# Altium schematic sheet TIMER_COUNTER_PANEL.SchDoc
size 381 x 241 mm; SheetNumber: 1; SheetTotal: 1
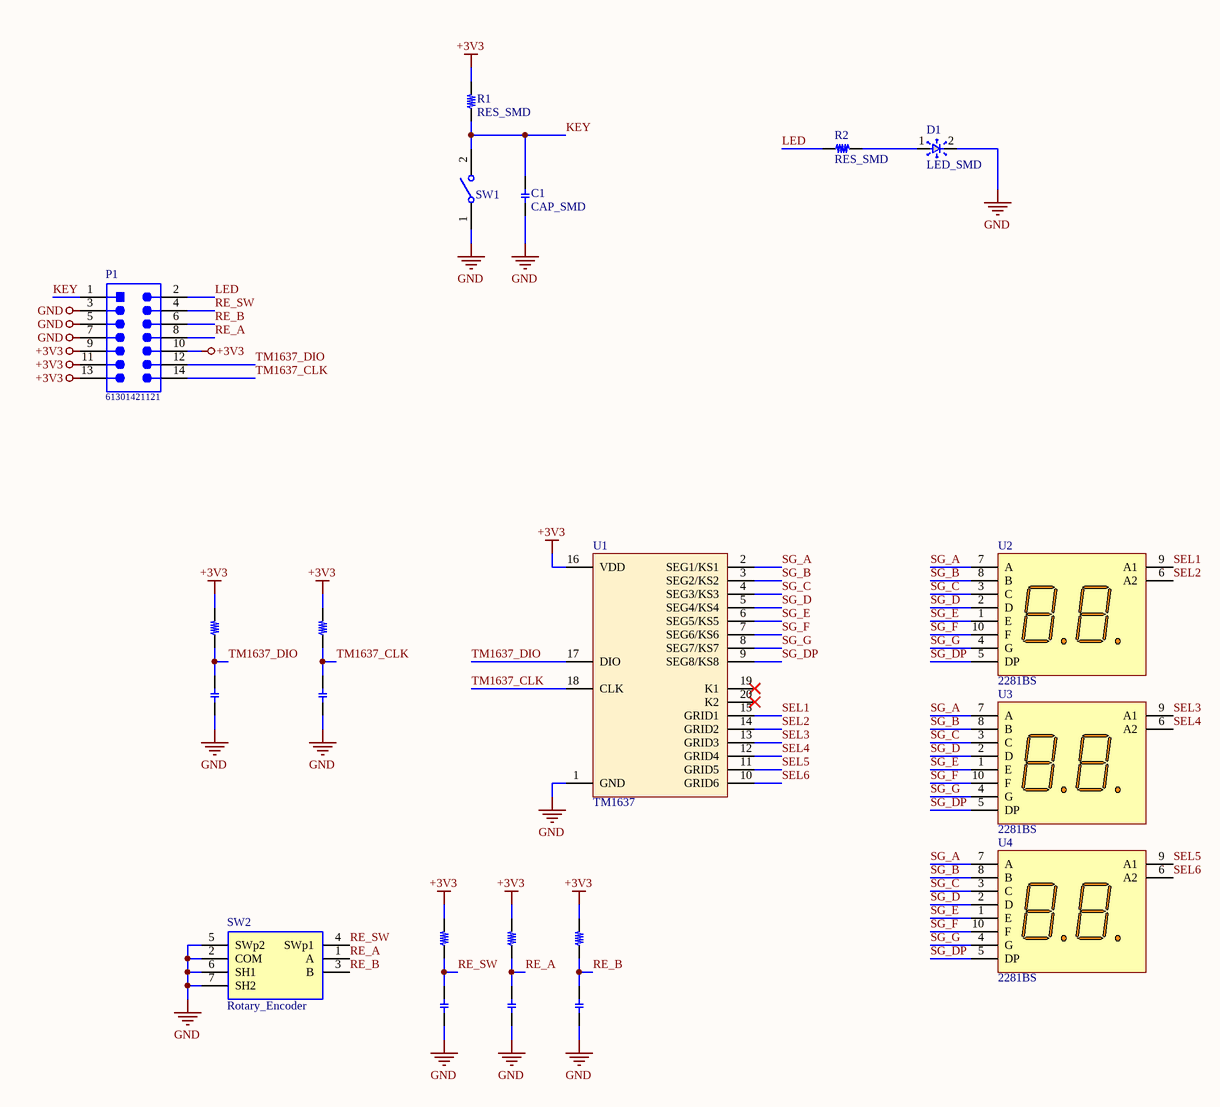
[diagram p0: TIMER_COUNTER_PANEL.SchDoc]

## Parts
C1  CAP_SMD  [C 0603]
C2  CAP_SMD  [C 0603]  (value not drawn)
C3  CAP_SMD  [C 0603]  (value not drawn)
C4  CAP_SMD  [C 0603]  (value not drawn)
C5  CAP_SMD  [C 0603]  (value not drawn)
C6  CAP_SMD  [C 0603]  (value not drawn)
D1  LED_SMD  [D 0603]
P1  61301421121  [61301421121]
R1  RES_SMD  [R 0603]
R2  RES_SMD  [R 0603]
R3  RES_SMD  [R 0603]  (value not drawn)
R4  RES_SMD  [R 0603]  (value not drawn)
R5  RES_SMD  [R 0603]  (value not drawn)
R6  RES_SMD  [R 0603]  (value not drawn)
R7  RES_SMD  [R 0603]  (value not drawn)
SW1  430133050816  [WS-TASV_L6W6H5_4301330508x6]  (value not drawn)
SW2  Rotary_Encoder  [Rotary_Encoder]
U1  TM1637  [SOP-20]
U2  2281BS  [2281BS]
U3  2281BS  [2281BS]
U4  2281BS  [2281BS]

## Nets
+3V3: P1.9 P1.10 P1.11 P1.13 R1.2 R3.2 R4.2 R5.2 R6.2 R7.2 U1.16(VDD)
GND: C1.1 C2.1 C3.1 C4.1 C5.1 C6.1 D1.2 P1.3 P1.5 P1.7 SW1.1 SW2.2(COM) SW2.5(SWp2) SW2.6(SH1) SW2.7(SH2) U1.1(GND)
KEY: C1.2 P1.1 R1.1 SW1.2
LED: P1.2 R2.1
RE_A: C5.2 P1.8 R6.1 SW2.1(A)
RE_B: C6.2 P1.6 R7.1 SW2.3(B)
RE_SW: C4.2 P1.4 R5.1 SW2.4(SWp1)
SEL1: U1.15(GRID1) U2.9(A1)
SEL2: U1.14(GRID2) U2.6(A2)
SEL3: U1.13(GRID3) U3.9(A1)
SEL4: U1.12(GRID4) U3.6(A2)
SEL5: U1.11(GRID5) U4.9(A1)
SEL6: U1.10(GRID6) U4.6(A2)
SG_A: U1.2(SEG1/KS1) U2.7(A) U3.7(A) U4.7(A)
SG_B: U1.3(SEG2/KS2) U2.8(B) U3.8(B) U4.8(B)
SG_C: U1.4(SEG3/KS3) U2.3(C) U3.3(C) U4.3(C)
SG_D: U1.5(SEG4/KS4) U2.2(D) U3.2(D) U4.2(D)
SG_DP: U1.9(SEG8/KS8) U2.5(DP) U3.5(DP) U4.5(DP)
SG_E: U1.6(SEG5/KS5) U2.1(E) U3.1(E) U4.1(E)
SG_F: U1.7(SEG6/KS6) U2.10(F) U3.10(F) U4.10(F)
SG_G: U1.8(SEG7/KS7) U2.4(G) U3.4(G) U4.4(G)
TM1637_CLK: C3.2 P1.14 R4.1 U1.18(CLK)
TM1637_DIO: C2.2 P1.12 R3.1 U1.17(DIO)
NetD1_1: D1.1 R2.2

Not connected (* = marked no-connect by the designer): U1 19(K1)* 20(K2)*

## Library data of the parts
P1 = 61301421121: WR-PHD Pin Header, THT, pitch 2.54mm, Dual Row, Vertical, 14p; Manufacturer: Wurth Elektronik; Pin Number: 14; Rated Current: 3A; Working Voltage: 250VAC; Withstanding Voltage: 500VAC; Contact Resistance: 20mOhm; ComponentLink1Description: Manufacturer; ComponentLink1URL: http://www.we-online.de; ComponentLink2Description: Datasheet; ComponentLink2URL: https://www.we-online.com/catalog/datasheet/61301421121.pdf; Manufacturer Part Number: 61301421121; Pitch: 2.54mm; Operating Temperature: -40 to +105degC; Mounting Technology: THT; Packaging: Bag; Gender: Pin Header; Row Number: Dual; Orientation: Vertical
SW1 = 430133050816: WS-TASV SMT long travel tact switch, L6 x W6 x H5mm, 160g, SPST-NO, 16V, 50mA; Manufacturer: Wurth Elektronik; Washable: No; Manufacturer Part Number: 430133050816; Category: Tact Switches; Match Code: WS-TASV; ComponentLink1Description: Website Link; ComponentLink1URL: https://www.we-online.com/redexpert/article/430133050816?ad; ComponentLink2Description: Datasheet Link; ComponentLink2URL: https://www.we-online.com/redexpert/spec/430133050816?ad; Mount: Surface Mount; Operating Temperature Max: 125°C; Operating Temperature Min: -40°C; Packaging: Tape and Reel; Length: 6mm; Width: 6mm; Height: 5mm; Circuit: SPST-NO; Contact Material: Stainless Steel; Contact Plating: Silver; Operation Force: 160g; Rated Current: 50mA; Rated Voltage (DC): 16V; Terminal Material: Copper Alloy; Terminal Plating: Silver